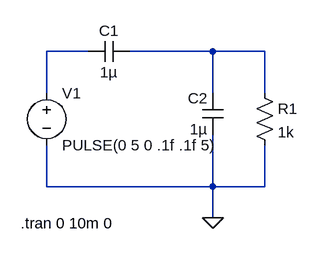
[diagram p0: schematic D_DC.asc]
D_DC.asc, the LTspice schematic file:
Version 4
SHEET 1 880 680
WIRE 128 96 64 96
WIRE 320 96 192 96
WIRE 400 96 320 96
WIRE 64 160 64 96
WIRE 320 160 320 96
WIRE 400 160 400 96
WIRE 64 304 64 240
WIRE 320 304 320 224
WIRE 320 304 64 304
WIRE 400 304 400 240
WIRE 400 304 320 304
WIRE 320 352 320 304
FLAG 320 352 0
SYMBOL cap 192 80 R90
WINDOW 0 0 32 VBottom 2
WINDOW 3 32 32 VTop 2
SYMATTR InstName C1
SYMATTR Value 1µ
SYMBOL cap 336 224 R180
WINDOW 0 24 56 Left 2
WINDOW 3 24 8 Left 2
SYMATTR InstName C2
SYMATTR Value 1µ
SYMBOL voltage 64 144 R0
WINDOW 123 0 0 Left 0
WINDOW 39 0 0 Left 0
SYMATTR InstName V1
SYMATTR Value PULSE(0 5 0 .1f .1f 5)
SYMBOL res 384 144 R0
SYMATTR InstName R1
SYMATTR Value 1k
TEXT 24 360 Left 2 !.tran 0 10m 0

The netlist it stands for:
* D_DC.asc
C1 N002 N001 1µ
C2 0 N002 1µ
V1 N001 0 PULSE(0 5 0 .1f .1f 5)
R1 N002 0 1k
.tran 0 10m 0
.backanno
.end